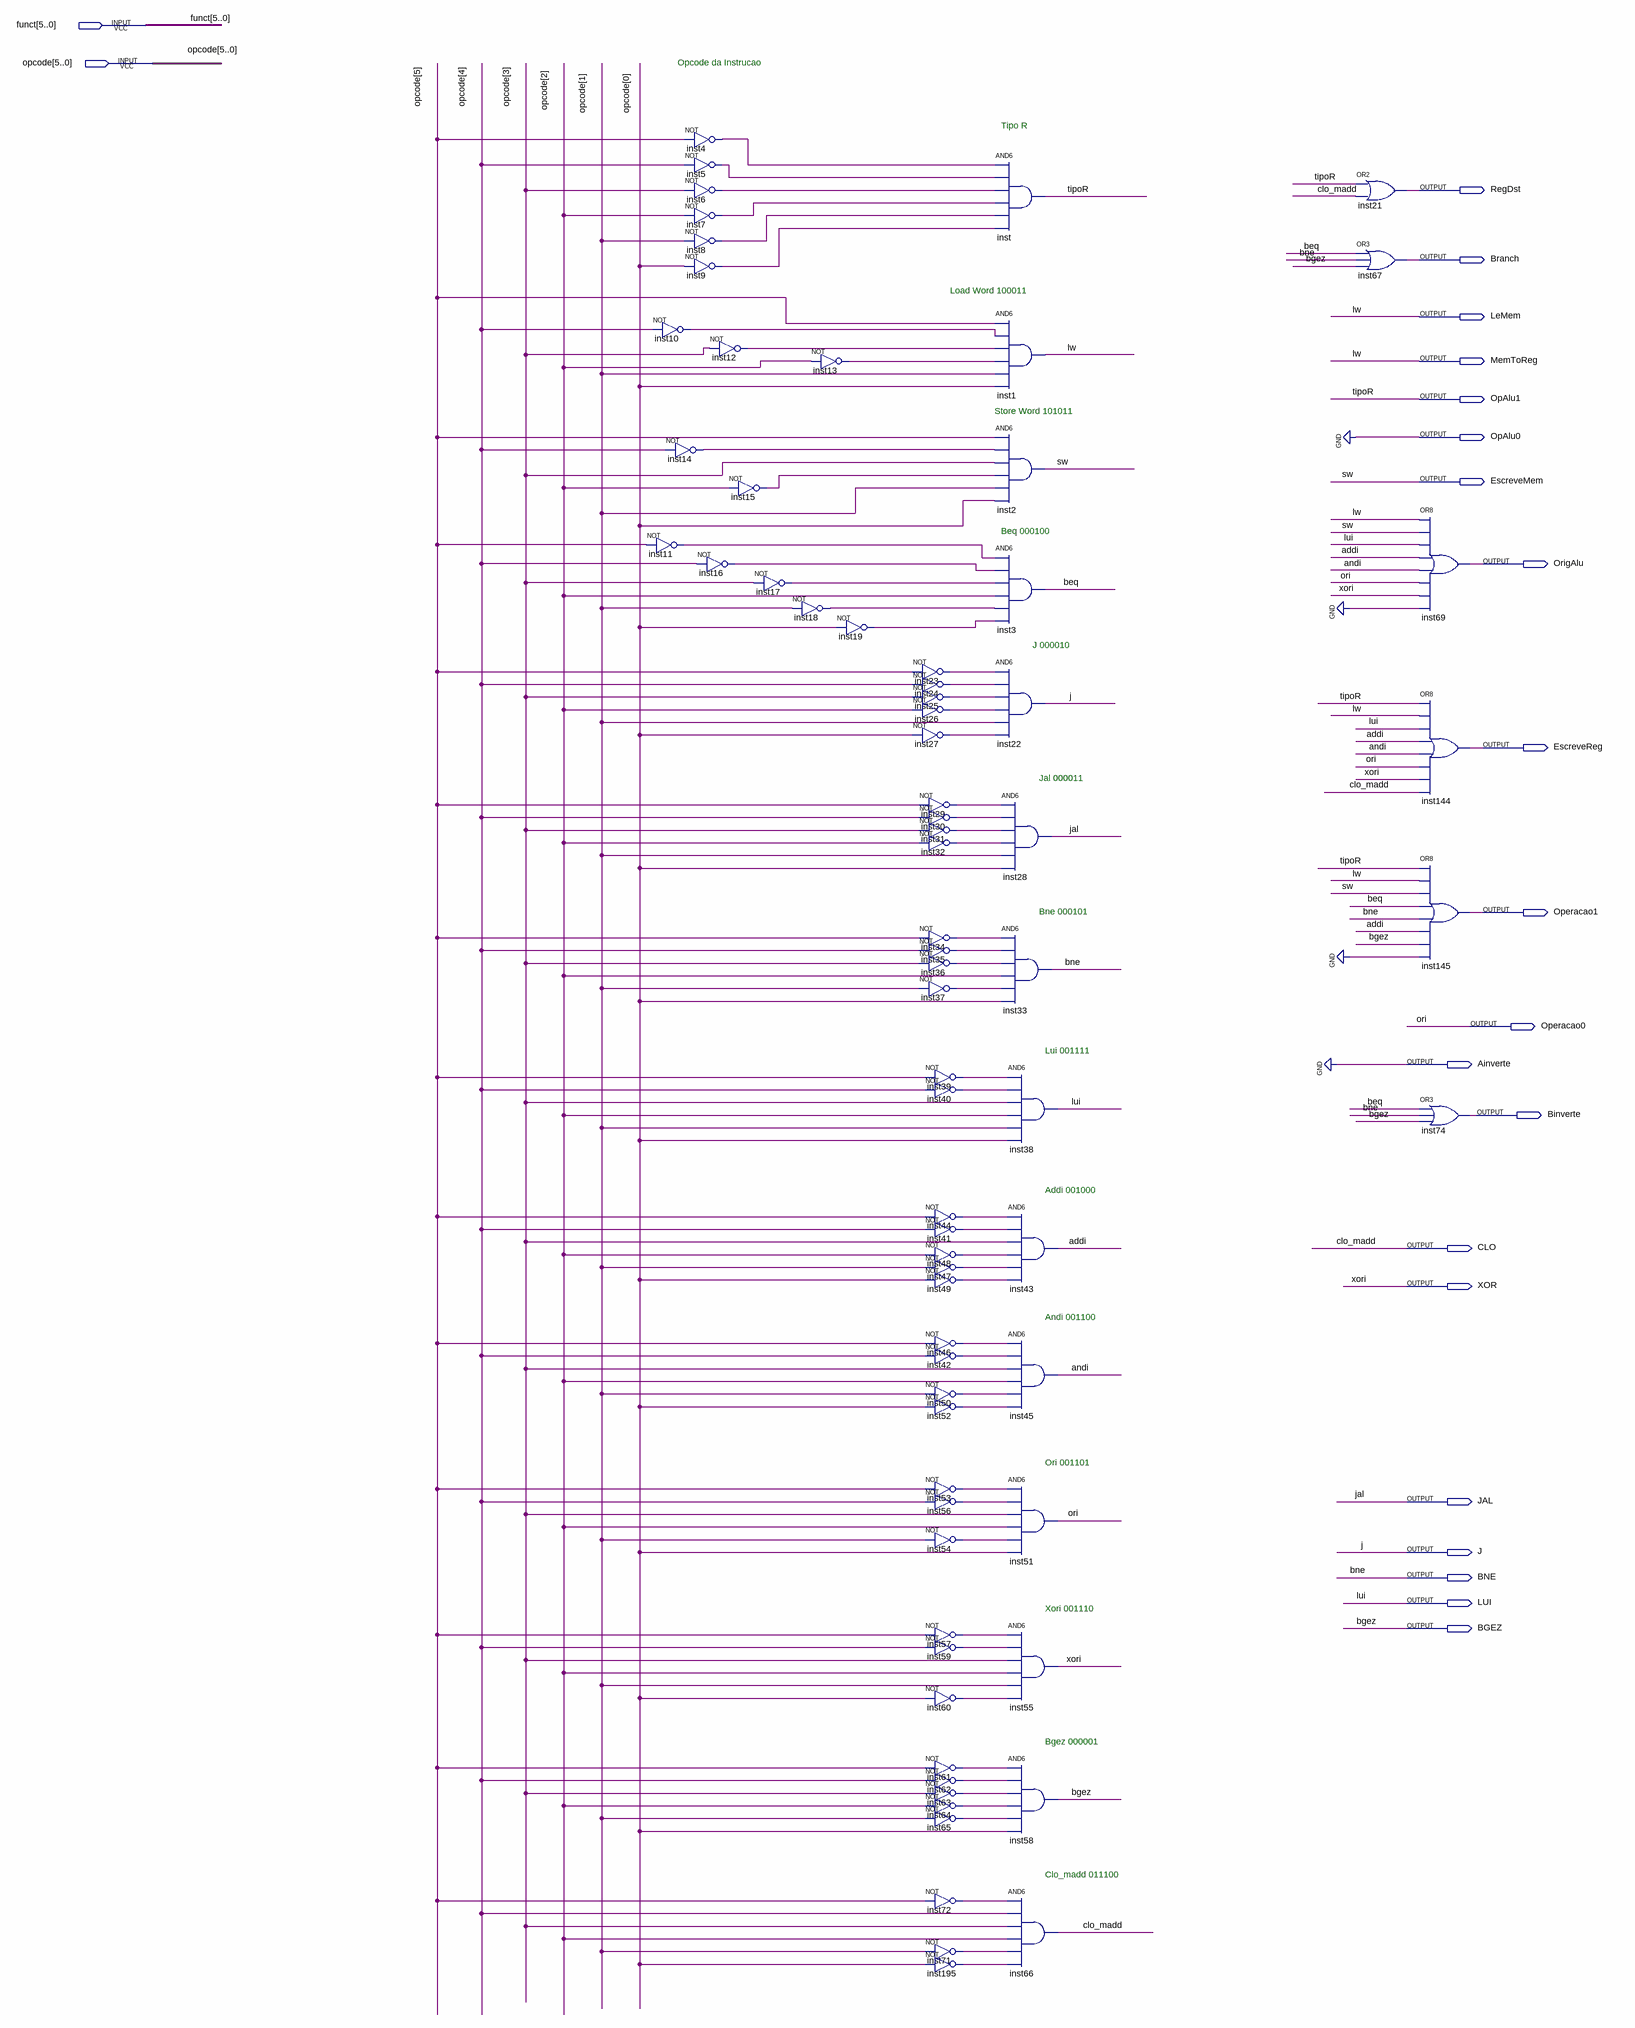
[diagram p0: schematic sheet]
// Quartus schematic controlePipe.bdf as structural Verilog: 74 symbols, 22 pins
module controlePipe (
  input  [5:0] funct,
  input  [5:0] opcode,
  output RegDst,
  output Branch,
  output LeMem,
  output MemToReg,
  output OpAlu1,
  output OpAlu0,
  output EscreveMem,
  output OrigAlu,
  output EscreveReg,
  output Operacao1,
  output Operacao0,
  output Ainverte,
  output Binverte,
  output CLO,
  output XOR,
  output JAL,
  output J,
  output BNE,
  output LUI,
  output BGEZ
);

  wire addi, andi, beq, inst4_out, inst5_out, inst6_out, inst7_out, inst8_out, inst9_out, inst10_out,
       inst11_out, inst12_out, inst13_out, inst14_out, inst15_out, inst16_out, inst17_out, inst18_out,
       inst19_out, inst23_out, inst24_out, inst25_out, inst26_out, inst27_out, inst29_out, inst30_out,
       inst31_out, inst32_out, inst34_out, inst35_out, inst36_out, inst37_out, inst39_out, inst40_out,
       inst41_out, inst42_out, inst44_out, inst46_out, inst47_out, inst48_out, inst49_out, inst50_out,
       inst52_out, inst53_out, inst54_out, inst56_out, inst57_out, inst59_out, inst60_out, inst61_out,
       inst62_out, inst63_out, inst64_out, inst65_out, inst71_out, inst72_out, inst195_out;

  not inst4 (inst4_out, opcode[5]);
  not inst5 (inst5_out, opcode[4]);
  not inst6 (inst6_out, opcode[3]);
  not inst7 (inst7_out, opcode[2]);
  not inst8 (inst8_out, opcode[1]);
  not inst9 (inst9_out, opcode[0]);
  not inst10 (inst10_out, opcode[4]);
  not inst14 (inst14_out, opcode[4]);
  not inst11 (inst11_out, opcode[5]);
  not inst12 (inst12_out, opcode[3]);
  not inst15 (inst15_out, opcode[2]);
  not inst16 (inst16_out, opcode[4]);
  not inst17 (inst17_out, opcode[3]);
  not inst13 (inst13_out, opcode[2]);
  not inst18 (inst18_out, opcode[1]);
  not inst19 (inst19_out, opcode[0]);
  not inst23 (inst23_out, opcode[5]);
  not inst24 (inst24_out, opcode[4]);
  not inst25 (inst25_out, opcode[3]);
  not inst26 (inst26_out, opcode[2]);
  not inst27 (inst27_out, opcode[0]);
  not inst29 (inst29_out, opcode[5]);
  not inst30 (inst30_out, opcode[4]);
  not inst31 (inst31_out, opcode[3]);
  not inst32 (inst32_out, opcode[2]);
  not inst34 (inst34_out, opcode[5]);
  not inst35 (inst35_out, opcode[4]);
  not inst36 (inst36_out, opcode[3]);
  not inst37 (inst37_out, opcode[1]);
  not inst39 (inst39_out, opcode[5]);
  not inst40 (inst40_out, opcode[4]);
  not inst44 (inst44_out, opcode[5]);
  not inst41 (inst41_out, opcode[4]);
  not inst48 (inst48_out, opcode[2]);
  not inst47 (inst47_out, opcode[1]);
  not inst49 (inst49_out, opcode[0]);
  not inst46 (inst46_out, opcode[5]);
  not inst42 (inst42_out, opcode[4]);
  not inst50 (inst50_out, opcode[1]);
  not inst52 (inst52_out, opcode[0]);
  not inst53 (inst53_out, opcode[5]);
  not inst56 (inst56_out, opcode[4]);
  not inst54 (inst54_out, opcode[1]);
  not inst57 (inst57_out, opcode[5]);
  not inst59 (inst59_out, opcode[4]);
  not inst60 (inst60_out, opcode[0]);
  not inst61 (inst61_out, opcode[5]);
  not inst62 (inst62_out, opcode[4]);
  not inst63 (inst63_out, opcode[3]);
  not inst64 (inst64_out, opcode[2]);
  not inst65 (inst65_out, opcode[1]);
  not inst72 (inst72_out, opcode[5]);
  not inst71 (inst71_out, opcode[1]);
  not inst195 (inst195_out, opcode[0]);
  and inst (OpAlu1, inst4_out, inst5_out, inst6_out, inst7_out, inst8_out, inst9_out);
  and inst1 (LeMem, opcode[5], inst10_out, inst12_out, inst13_out, opcode[1], opcode[0]);
  and inst2 (EscreveMem, opcode[5], inst14_out, opcode[3], inst15_out, opcode[1], opcode[0]);
  and inst3 (beq, inst11_out, inst16_out, inst17_out, opcode[2], inst18_out, inst19_out);
  and inst22 (J, inst23_out, inst24_out, inst25_out, inst26_out, opcode[1], inst27_out);
  and inst28 (JAL, inst29_out, inst30_out, inst31_out, inst32_out, opcode[1], opcode[0]);
  and inst33 (BNE, inst34_out, inst35_out, inst36_out, opcode[2], inst37_out, opcode[0]);
  and inst38 (LUI, inst39_out, inst40_out, opcode[3], opcode[2], opcode[1], opcode[0]);
  and inst43 (addi, inst44_out, inst41_out, opcode[3], inst48_out, inst47_out, inst49_out);
  and inst45 (andi, inst46_out, inst42_out, opcode[3], opcode[2], inst50_out, inst52_out);
  and inst51 (Operacao0, inst53_out, inst56_out, opcode[3], opcode[2], inst54_out, opcode[0]);
  and inst55 (XOR, inst57_out, inst59_out, opcode[3], opcode[2], opcode[1], inst60_out);
  and inst58 (BGEZ, inst61_out, inst62_out, inst63_out, inst64_out, inst65_out, opcode[0]);
  and inst66 (CLO, inst72_out, opcode[4], opcode[3], opcode[2], inst71_out, inst195_out);
  or inst21 (RegDst, OpAlu1, CLO);
  or inst67 (Branch, beq, BNE, BGEZ);
  or inst69 (OrigAlu, LeMem, EscreveMem, LUI, addi, andi, Operacao0, XOR, 1'b0);
  or inst144 (EscreveReg, OpAlu1, LeMem, LUI, addi, andi, Operacao0, XOR, CLO);
  or inst145 (Operacao1, OpAlu1, LeMem, EscreveMem, beq, BNE, addi, BGEZ, 1'b0);
  or inst74 (Binverte, beq, BNE, BGEZ);

  assign Ainverte = 1'b0;
  assign MemToReg = LeMem;
  assign OpAlu0 = 1'b0;

  // Other names for the same wires on the sheet: clo_madd = CLO; lw = LeMem; ori = Operacao0; sw = EscreveMem;
  //   tipoR = OpAlu1; xori = XOR

  // Notes on the sheet:
  //   Opcode da Instrucao
  //   Tipo R
  //   Load Word 100011
  //   Store Word 101011
  //   Beq 000100
  //   J 000010
  //   Jal 000011
  //   Bne 000101
  //   Lui 001111
  //   Addi 001000
  //   Andi 001100
  //   Ori 001101
  //   Xori 001110
  //   Bgez 000001
  //   Clo_madd 011100
endmodule
